# Altium schematic sheet dram.schdoc: DRAM
size A4; Date: 02.10.2025; CheckedBy: BCY; DrawnBy: miaow; Revision: v1.0.0; SheetNumber: 5; SheetTotal: 17; BoardType: MAIN_PCB; Desc: LPDDR4
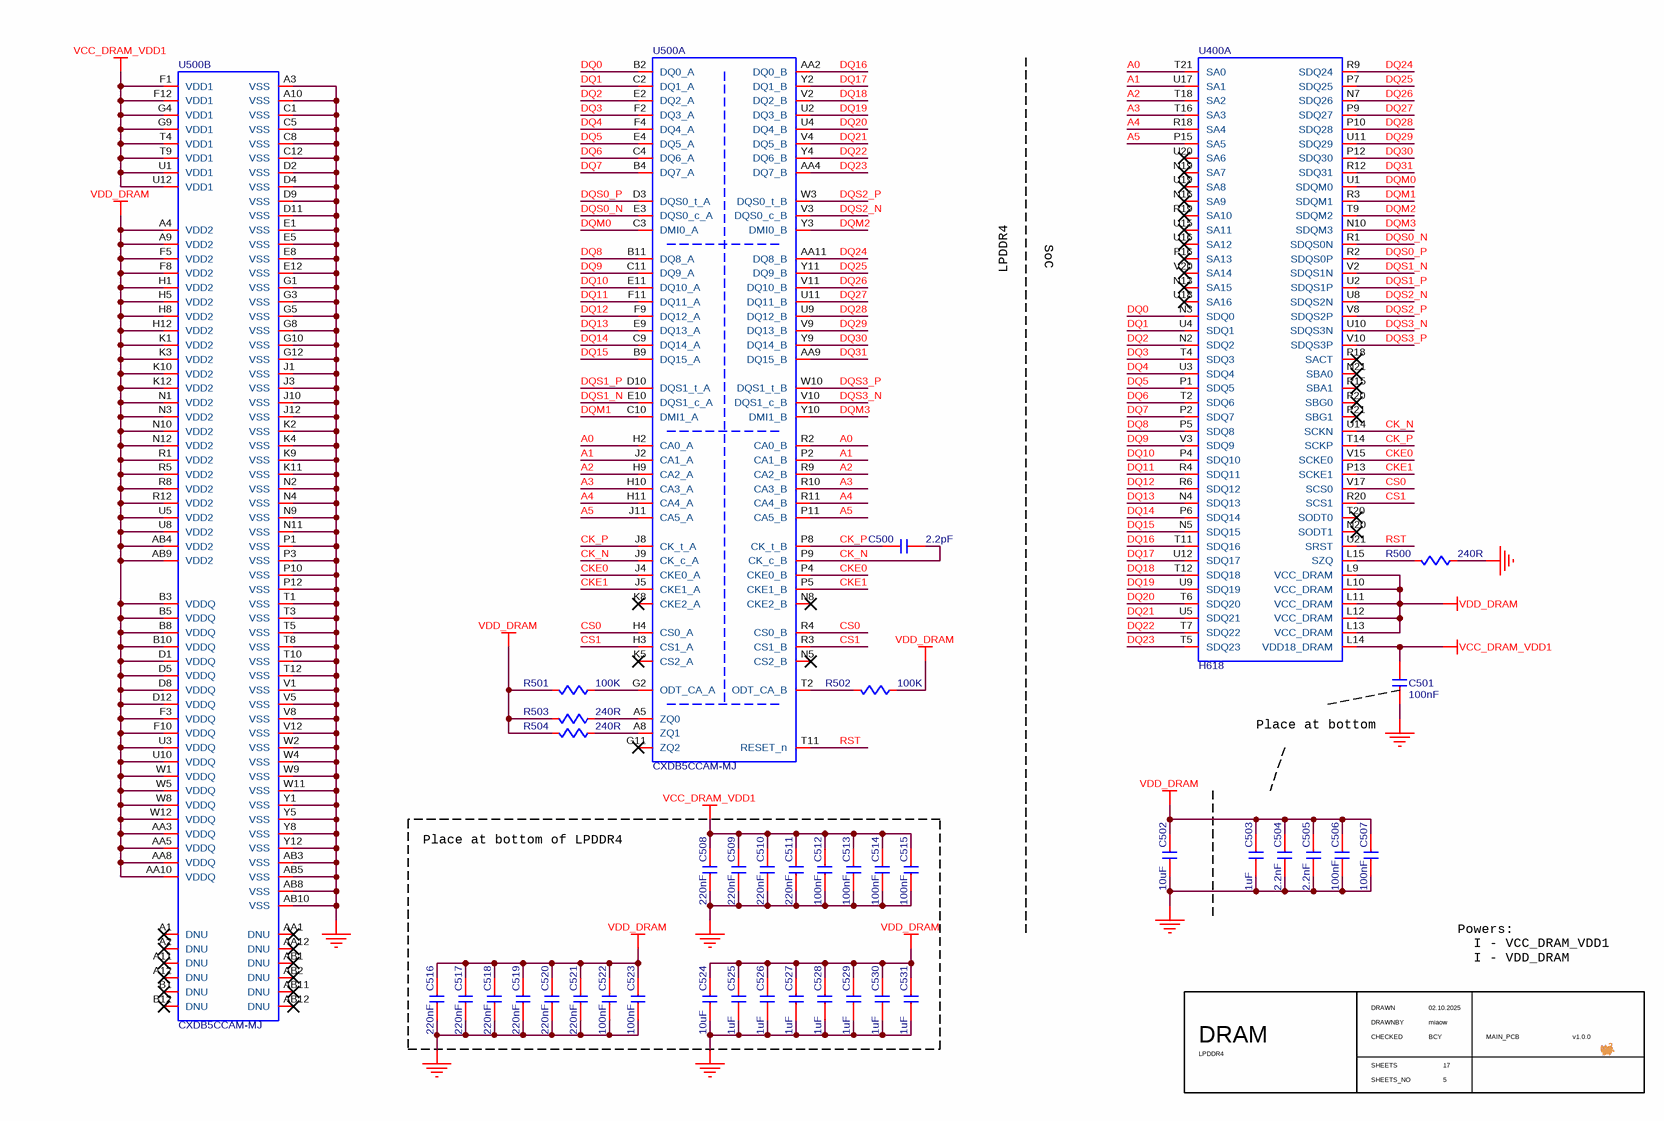
[diagram p0: dram.schdoc]

## Parts
C500  value 2.2pF  [C0201]  (hidden comment: C-NOMO)
C501  value 100nF  [C0201]  (hidden comment: C-NOMO)
C502  value 10uF  [C0402]  (hidden comment: C-NOMO)
C503  value 1uF  [C0201]  (hidden comment: C-NOMO)
C504  value 2.2nF  [C0201]  (hidden comment: C-NOMO)
C505  value 2.2nF  [C0201]  (hidden comment: C-NOMO)
C506  value 100nF  [C0201]  (hidden comment: C-NOMO)
C507  value 100nF  [C0201]  (hidden comment: C-NOMO)
C508  value 220nF  [C0201]  (hidden comment: C-NOMO)
C509  value 220nF  [C0201]  (hidden comment: C-NOMO)
C510  value 220nF  [C0201]  (hidden comment: C-NOMO)
C511  value 220nF  [C0201]  (hidden comment: C-NOMO)
C512  value 100nF  [C0201]  (hidden comment: C-NOMO)
C513  value 100nF  [C0201]  (hidden comment: C-NOMO)
C514  value 100nF  [C0201]  (hidden comment: C-NOMO)
C515  value 100nF  [C0201]  (hidden comment: C-NOMO)
C516  value 220nF  [C0201]  (hidden comment: C-NOMO)
C517  value 220nF  [C0201]  (hidden comment: C-NOMO)
C518  value 220nF  [C0201]  (hidden comment: C-NOMO)
C519  value 220nF  [C0201]  (hidden comment: C-NOMO)
C520  value 220nF  [C0201]  (hidden comment: C-NOMO)
C521  value 220nF  [C0201]  (hidden comment: C-NOMO)
C522  value 100nF  [C0201]  (hidden comment: C-NOMO)
C523  value 100nF  [C0201]  (hidden comment: C-NOMO)
C524  value 10uF  [C0402]  (hidden comment: C-NOMO)
C525  value 1uF  [C0201]  (hidden comment: C-NOMO)
C526  value 1uF  [C0201]  (hidden comment: C-NOMO)
C527  value 1uF  [C0201]  (hidden comment: C-NOMO)
C528  value 1uF  [C0201]  (hidden comment: C-NOMO)
C529  value 1uF  [C0201]  (hidden comment: C-NOMO)
C530  value 1uF  [C0201]  (hidden comment: C-NOMO)
C531  value 1uF  [C0201]  (hidden comment: C-NOMO)
R500  value 240R  [R0402]  (hidden comment: R)
R501  value 100K  [R0402]  (hidden comment: R)
R502  value 100K  [R0402]  (hidden comment: R)
R503  value 240R  [R0402]  (hidden comment: R)
R504  value 240R  [R0402]  (hidden comment: R)
U400  H618  [H618]  (part A of 4)
U500  CXDB5CCAM-MJ  [CXDB5CCAM-MJ]  (parts A,B of 2)

## Blocks framed on the sheet
Place at bottom of LPDDR4: C508-C531

## Nets
GND: C501.1 C502.1 C503.1 C504.1 C505.1 C506.1 C507.1 C508.1 C509.1 C510.1 C511.1 C512.1 C513.1 C514.1 C515.1 C516.1 C517.1 C518.1 C519.1 C520.1 C521.1 C522.1 C523.1 C524.1 C525.1 C526.1 C527.1 C528.1 C529.1 C530.1 C531.1 R500.2 U500.A3(VSS) U500.A10(VSS) U500.AB3(VSS) U500.AB5(VSS) U500.AB8(VSS) U500.AB10(VSS) U500.C1(VSS) U500.C5(VSS) U500.C8(VSS) U500.C12(VSS) U500.D2(VSS) U500.D4(VSS) U500.D9(VSS) U500.D11(VSS) U500.E1(VSS) U500.E5(VSS) U500.E8(VSS) U500.E12(VSS) U500.G1(VSS) U500.G3(VSS) U500.G5(VSS) U500.G8(VSS) U500.G10(VSS) U500.G12(VSS) U500.J1(VSS) U500.J3(VSS) U500.J10(VSS) U500.J12(VSS) U500.K2(VSS) U500.K4(VSS) U500.K9(VSS) U500.K11(VSS) U500.N2(VSS) U500.N4(VSS) U500.N9(VSS) U500.N11(VSS) U500.P1(VSS) U500.P3(VSS) U500.P10(VSS) U500.P12(VSS) U500.T1(VSS) U500.T3(VSS) U500.T5(VSS) U500.T8(VSS) U500.T10(VSS) U500.T12(VSS) U500.V1(VSS) U500.V5(VSS) U500.V8(VSS) U500.V12(VSS) U500.W2(VSS) U500.W4(VSS) U500.W9(VSS) U500.W11(VSS) U500.Y1(VSS) U500.Y5(VSS) U500.Y8(VSS) U500.Y12(VSS)
VCC_DRAM_VDD1: C501.2 C508.2 C509.2 C510.2 C511.2 C512.2 C513.2 C514.2 C515.2 U400.L14(VDD18_DRAM) U500.F1(VDD1) U500.F12(VDD1) U500.G4(VDD1) U500.G9(VDD1) U500.T4(VDD1) U500.T9(VDD1) U500.U1(VDD1) U500.U12(VDD1)
VDD_DRAM: C502.2 C503.2 C504.2 C505.2 C506.2 C507.2 C516.2 C517.2 C518.2 C519.2 C520.2 C521.2 C522.2 C523.2 C524.2 C525.2 C526.2 C527.2 C528.2 C529.2 C530.2 C531.2 R501.1 R502.2 R503.1 R504.1 U400.L9(VCC_DRAM) U400.L10(VCC_DRAM) U400.L11(VCC_DRAM) U400.L12(VCC_DRAM) U400.L13(VCC_DRAM) U500.A4(VDD2) U500.A9(VDD2) U500.AA3(VDDQ) U500.AA5(VDDQ) U500.AA8(VDDQ) U500.AA10(VDDQ) U500.AB4(VDD2) U500.AB9(VDD2) U500.B3(VDDQ) U500.B5(VDDQ) U500.B8(VDDQ) U500.B10(VDDQ) U500.D1(VDDQ) U500.D5(VDDQ) U500.D8(VDDQ) U500.D12(VDDQ) U500.F3(VDDQ) U500.F5(VDD2) U500.F8(VDD2) U500.F10(VDDQ) U500.H1(VDD2) U500.H5(VDD2) U500.H8(VDD2) U500.H12(VDD2) U500.K1(VDD2) U500.K3(VDD2) U500.K10(VDD2) U500.K12(VDD2) U500.N1(VDD2) U500.N3(VDD2) U500.N10(VDD2) U500.N12(VDD2) U500.R1(VDD2) U500.R5(VDD2) U500.R8(VDD2) U500.R12(VDD2) U500.U3(VDDQ) U500.U5(VDD2) U500.U8(VDD2) U500.U10(VDDQ) U500.W1(VDDQ) U500.W5(VDDQ) U500.W8(VDDQ) U500.W12(VDDQ)
A0: U400.T21(SA0) U500.H2(CA0_A) U500.R2(CA0_B)
A1: U400.U17(SA1) U500.J2(CA1_A) U500.P2(CA1_B)
A2: U400.T18(SA2) U500.H9(CA2_A) U500.R9(CA2_B)
A3: U400.T16(SA3) U500.H10(CA3_A) U500.R10(CA3_B)
A4: U400.R18(SA4) U500.H11(CA4_A) U500.R11(CA4_B)
A5: U400.P15(SA5) U500.J11(CA5_A) U500.P11(CA5_B)
CK_N: C500.1 U400.U14(SCKN) U500.J9(CK_c_A) U500.P9(CK_c_B)
CK_P: C500.2 U400.T14(SCKP) U500.J8(CK_t_A) U500.P8(CK_t_B)
CKE0: U400.V15(SCKE0) U500.J4(CKE0_A) U500.P4(CKE0_B)
CKE1: U400.P13(SCKE1) U500.J5(CKE1_A) U500.P5(CKE1_B)
CS0: U400.V17(SCS0) U500.H4(CS0_A) U500.R4(CS0_B)
CS1: U400.R20(SCS1) U500.H3(CS1_A) U500.R3(CS1_B)
DQ0: U400.N3(SDQ0) U500.B2(DQ0_A)
DQ1: U400.U4(SDQ1) U500.C2(DQ1_A)
DQ2: U400.N2(SDQ2) U500.E2(DQ2_A)
DQ3: U400.T4(SDQ3) U500.F2(DQ3_A)
DQ4: U400.U3(SDQ4) U500.F4(DQ4_A)
DQ5: U400.P1(SDQ5) U500.E4(DQ5_A)
DQ6: U400.T2(SDQ6) U500.C4(DQ6_A)
DQ7: U400.P2(SDQ7) U500.B4(DQ7_A)
DQ8: U400.P5(SDQ8) U500.B11(DQ8_A)
DQ9: U400.V3(SDQ9) U500.C11(DQ9_A)
DQ10: U400.P4(SDQ10) U500.E11(DQ10_A)
DQ11: U400.R4(SDQ11) U500.F11(DQ11_A)
DQ12: U400.R6(SDQ12) U500.F9(DQ12_A)
DQ13: U400.N4(SDQ13) U500.E9(DQ13_A)
DQ14: U400.P6(SDQ14) U500.C9(DQ14_A)
DQ15: U400.N5(SDQ15) U500.B9(DQ15_A)
DQ16: U400.T11(SDQ16) U500.AA2(DQ0_B)
DQ17: U400.U12(SDQ17) U500.Y2(DQ1_B)
DQ18: U400.T12(SDQ18) U500.V2(DQ2_B)
DQ19: U400.U9(SDQ19) U500.U2(DQ3_B)
DQ20: U400.T6(SDQ20) U500.U4(DQ4_B)
DQ21: U400.U5(SDQ21) U500.V4(DQ5_B)
DQ22: U400.T7(SDQ22) U500.Y4(DQ6_B)
DQ23: U400.T5(SDQ23) U500.AA4(DQ7_B)
DQ24: U400.R9(SDQ24) U500.AA11(DQ8_B)
DQ25: U400.P7(SDQ25) U500.Y11(DQ9_B)
DQ26: U400.N7(SDQ26) U500.V11(DQ10_B)
DQ27: U400.P9(SDQ27) U500.U11(DQ11_B)
DQ28: U400.P10(SDQ28) U500.U9(DQ12_B)
DQ29: U400.U11(SDQ29) U500.V9(DQ13_B)
DQ30: U400.P12(SDQ30) U500.Y9(DQ14_B)
DQ31: U400.R12(SDQ31) U500.AA9(DQ15_B)
DQM0: U400.U1(SDQM0) U500.C3(DMI0_A)
DQM1: U400.R3(SDQM1) U500.C10(DMI1_A)
DQM2: U400.T9(SDQM2) U500.Y3(DMI0_B)
DQM3: U400.N10(SDQM3) U500.Y10(DMI1_B)
DQS0_N: U400.R1(SDQS0N) U500.E3(DQS0_c_A)
DQS0_P: U400.R2(SDQS0P) U500.D3(DQS0_t_A)
DQS1_N: U400.V2(SDQS1N) U500.E10(DQS1_c_A)
DQS1_P: U400.U2(SDQS1P) U500.D10(DQS1_t_A)
DQS2_N: U400.U8(SDQS2N) U500.V3(DQS0_c_B)
DQS2_P: U400.V8(SDQS2P) U500.W3(DQS0_t_B)
DQS3_N: U400.U10(SDQS3N) U500.V10(DQS1_c_B)
DQS3_P: U400.V10(SDQS3P) U500.W10(DQS1_t_B)
RST: U400.U21(SRST) U500.T11(RESET_n)
NetR500_1: R500.1 U400.L15(SZQ)
NetR501_2: R501.2 U500.G2(ODT_CA_A)
NetR502_1: R502.1 U500.T2(ODT_CA_B)
NetR503_2: R503.2 U500.A5(ZQ0)
NetR504_2: R504.2 U500.A8(ZQ1)

Not connected (* = marked no-connect by the designer): U400 N13(SA15)* N16(SA9)* N19(SA7)* N20(SODT1)* N21(SBA0)* P16(SA13)* P18(SACT)* P20(SBG0)* P21(SBG1)* R15(SBA1)* R19(SA10)* T20(SODT0)* U15(SA11)* U16(SA12)* U18(SA16)* U19(SA8)* U20(SA6)* V20(SA14)*; U500 A1(DNU)* A2(DNU)* A11(DNU)* A12(DNU)* AA1(DNU)* AA12(DNU)* AB1(DNU)* AB2(DNU)* AB11(DNU)* AB12(DNU)* B1(DNU)* B12(DNU)* G11(ZQ2)* K5(CS2_A)* K8(CKE2_A)* N5(CS2_B)* N8(CKE2_B)*

## Notes on the sheet
- LPDDR4
- SoC
- Place at bottom
- Powers:
  I - VCC_DRAM_VDD1
  I - VDD_DRAM
- DRAWN
- CHECKED
- DRAWNBY
- SHEETS
- SHEETS_NO

## Library data of the parts
C500 = C-NOMO: voltage: 25V; precision: 0.25pF; Supplier 1: LCSC; Supplier Part Number 1: C514586
C501 C506 C507 C512-C515 C522 C523 = C-NOMO: voltage: 10V; precision: 10%; Supplier 1: LCSC; Supplier Part Number 1: C49062
C502 C503 C508-C511 C516-C521 C524-C531 = C-NOMO: voltage: 6.3V; precision: 20%; Supplier 1: LCSC
  C502 C524: Supplier Part Number 1: C15525
  C503 C525-C531: Supplier Part Number 1: C53067
  C508-C511 C516-C521: Supplier Part Number 1: C34696
C504 C505 = C-NOMO: voltage: 50V; precision: 10%; Supplier 1: LCSC; Supplier Part Number 1: C80433
R500-R504 = R: precision: 1%; Supplier 1: LCSC
  R500 R503 R504: Supplier Part Number 1: C2909339
  R501 R502: Supplier Part Number 1: C25741
U400 = H618: SOC; Supplier 1: LCSC; Supplier Part Number 1: C19189292
U500 = CXDB5CCAM-MJ: DDR - LPDDR4; Supplier 1: LCSC; Supplier Part Number 1: C39047067